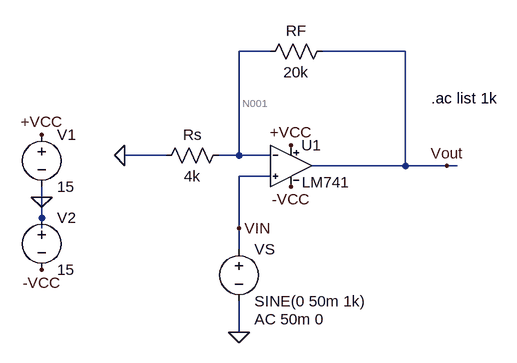
[diagram p0: schematic Non-Inverting.asc]
Non-Inverting.asc, the LTspice schematic file:
Version 4
SHEET 1 880 680
WIRE 208 -64 160 -64
WIRE 416 -64 288 -64
WIRE 48 96 -16 96
WIRE 160 96 160 -64
WIRE 160 96 128 96
WIRE 208 96 160 96
WIRE 416 112 416 -64
WIRE 416 112 272 112
WIRE 480 112 416 112
WIRE 496 112 480 112
WIRE 208 128 160 128
WIRE -144 160 -144 144
WIRE -144 192 -144 160
WIRE -144 208 -144 192
WIRE 160 208 160 128
WIRE 160 240 160 208
WIRE 160 368 160 320
FLAG -144 64 +VCC
FLAG 240 80 +VCC
FLAG 480 112 Vout
FLAG 160 368 0
FLAG -144 272 -VCC
FLAG 240 144 -VCC
FLAG -144 160 0
FLAG 160 208 VIN
FLAG -16 96 0
SYMBOL LM741 240 48 R0
SYMATTR InstName U1
SYMBOL voltage -144 48 R0
WINDOW 123 0 0 Left 0
WINDOW 39 0 0 Left 0
SYMATTR InstName V1
SYMATTR Value 15
SYMBOL voltage -144 176 R0
WINDOW 123 0 0 Left 0
WINDOW 39 0 0 Left 0
SYMATTR InstName V2
SYMATTR Value 15
SYMBOL voltage 160 224 R0
WINDOW 123 24 124 Left 2
WINDOW 39 0 0 Left 0
SYMATTR Value2 AC 50m 0
SYMATTR InstName VS
SYMATTR Value SINE(0 50m 1k)
SYMBOL res 144 80 R90
WINDOW 0 0 56 VBottom 2
WINDOW 3 32 56 VTop 2
SYMATTR InstName Rs
SYMATTR Value 4k
SYMBOL res 304 -80 R90
WINDOW 0 0 56 VBottom 2
WINDOW 3 32 56 VTop 2
SYMATTR InstName RF
SYMATTR Value 20k
TEXT 456 8 Left 2 !.ac list 1k

The netlist it stands for:
* Non-Inverting.asc
XU1 VIN N001 +VCC -VCC Vout LM741  ; pins In+ In- V+ V- OUT
V1 +VCC 0 15
V2 0 -VCC 15
VS VIN 0 SINE(0 50m 1k) AC 50m 0
Rs N001 0 4k
RF Vout N001 20k
.ac list 1k
.lib LM741.lib
.backanno
.end

* Results of the author's LTspice run, read from the files saved beside the schematic
* Operating Point, zero values left out:
*   V(n001) = 1 mV
*   V(-vcc) = -15 V
*   V(+vcc) = 15 V
*   V(vout) = 8.037 mV
*   I(Rf) = 351.9 nA
*   I(Rs) = 250 nA
*   I(Vs) = -57.86 nA
*   I(V2) = -1.701 mA
*   I(V1) = -1.701 mA
*   Ix(u1:1) = 57.86 nA
*   Ix(u1:2) = 101.9 nA
*   Ix(u1:99) = 1.701 mA
*   Ix(u1:50) = -1.701 mA
*   Ix(u1:28) = -351.9 nA
* AC Analysis:
*   frequency = 1 k
*   V(n001) = 50 mV
*   V(vin) = 50 mV
*   V(-vcc) = 0 V
*   V(+vcc) = 0 V
*   V(vout) = 300 mV
*   I(Rf) = 12.5 µA
*   I(Rs) = 12.5 µA
*   I(Vs) = -8.188 pA
*   I(V2) = 6.236 µA
*   I(V1) = -6.263 µA
*   Ix(u1:1) = 8.188 pA
*   Ix(u1:2) = -8.088 pA
*   Ix(u1:99) = 6.263 µA
*   Ix(u1:50) = 6.236 µA
*   Ix(u1:28) = -12.5 µA